# Altium schematic sheet PowerSupply.SchDoc: Power Supplies
size A3; ApprovedBy: Yves Chevallier; CheckedBy: Yves Chevallier; Author: Yves Chevallier; CompanyName: HEIG-VD; DrawnBy: Yves Chevallier; Engineer: Yves Chevallier; Organization: HEIG-VD; Address1: HEIG-VD; Address2: CH-1400 Yverdon-les-Bains; Address3: +41 21 557 73 77; Address4: +41 24 557 63 20; DocumentNumber: ABC.00.0000.000.0; Revision: v2.0.0; SheetNumber: 1; SheetTotal: 6; DrawnByDate: 2008-01-01; ExecutionWarrantDate: 2008-01-01; ExecutionWarrant: Yves Chevallier; Context: CRH; PageSetup: Record=PageOptions|CenterHorizontal=True|CenterVertical=False|PrintScale=0.97|XCorrection=1.00|YCorrection=1.00|PrintKind=0|BorderSize=5000000|LeftOffset=0|BottomOffset=0|Orientation=2|PaperLength=1000|PaperWidth=1000|Scale=100|PaperSource=262|PrintQuality=600|MediaType=1|DitherType=10|PaperKind=A4|PrintScaleMode=1; EngineerDate: 2008 -01-01; CheckedByDate: 2008-01-01; ProjectName: PRJ
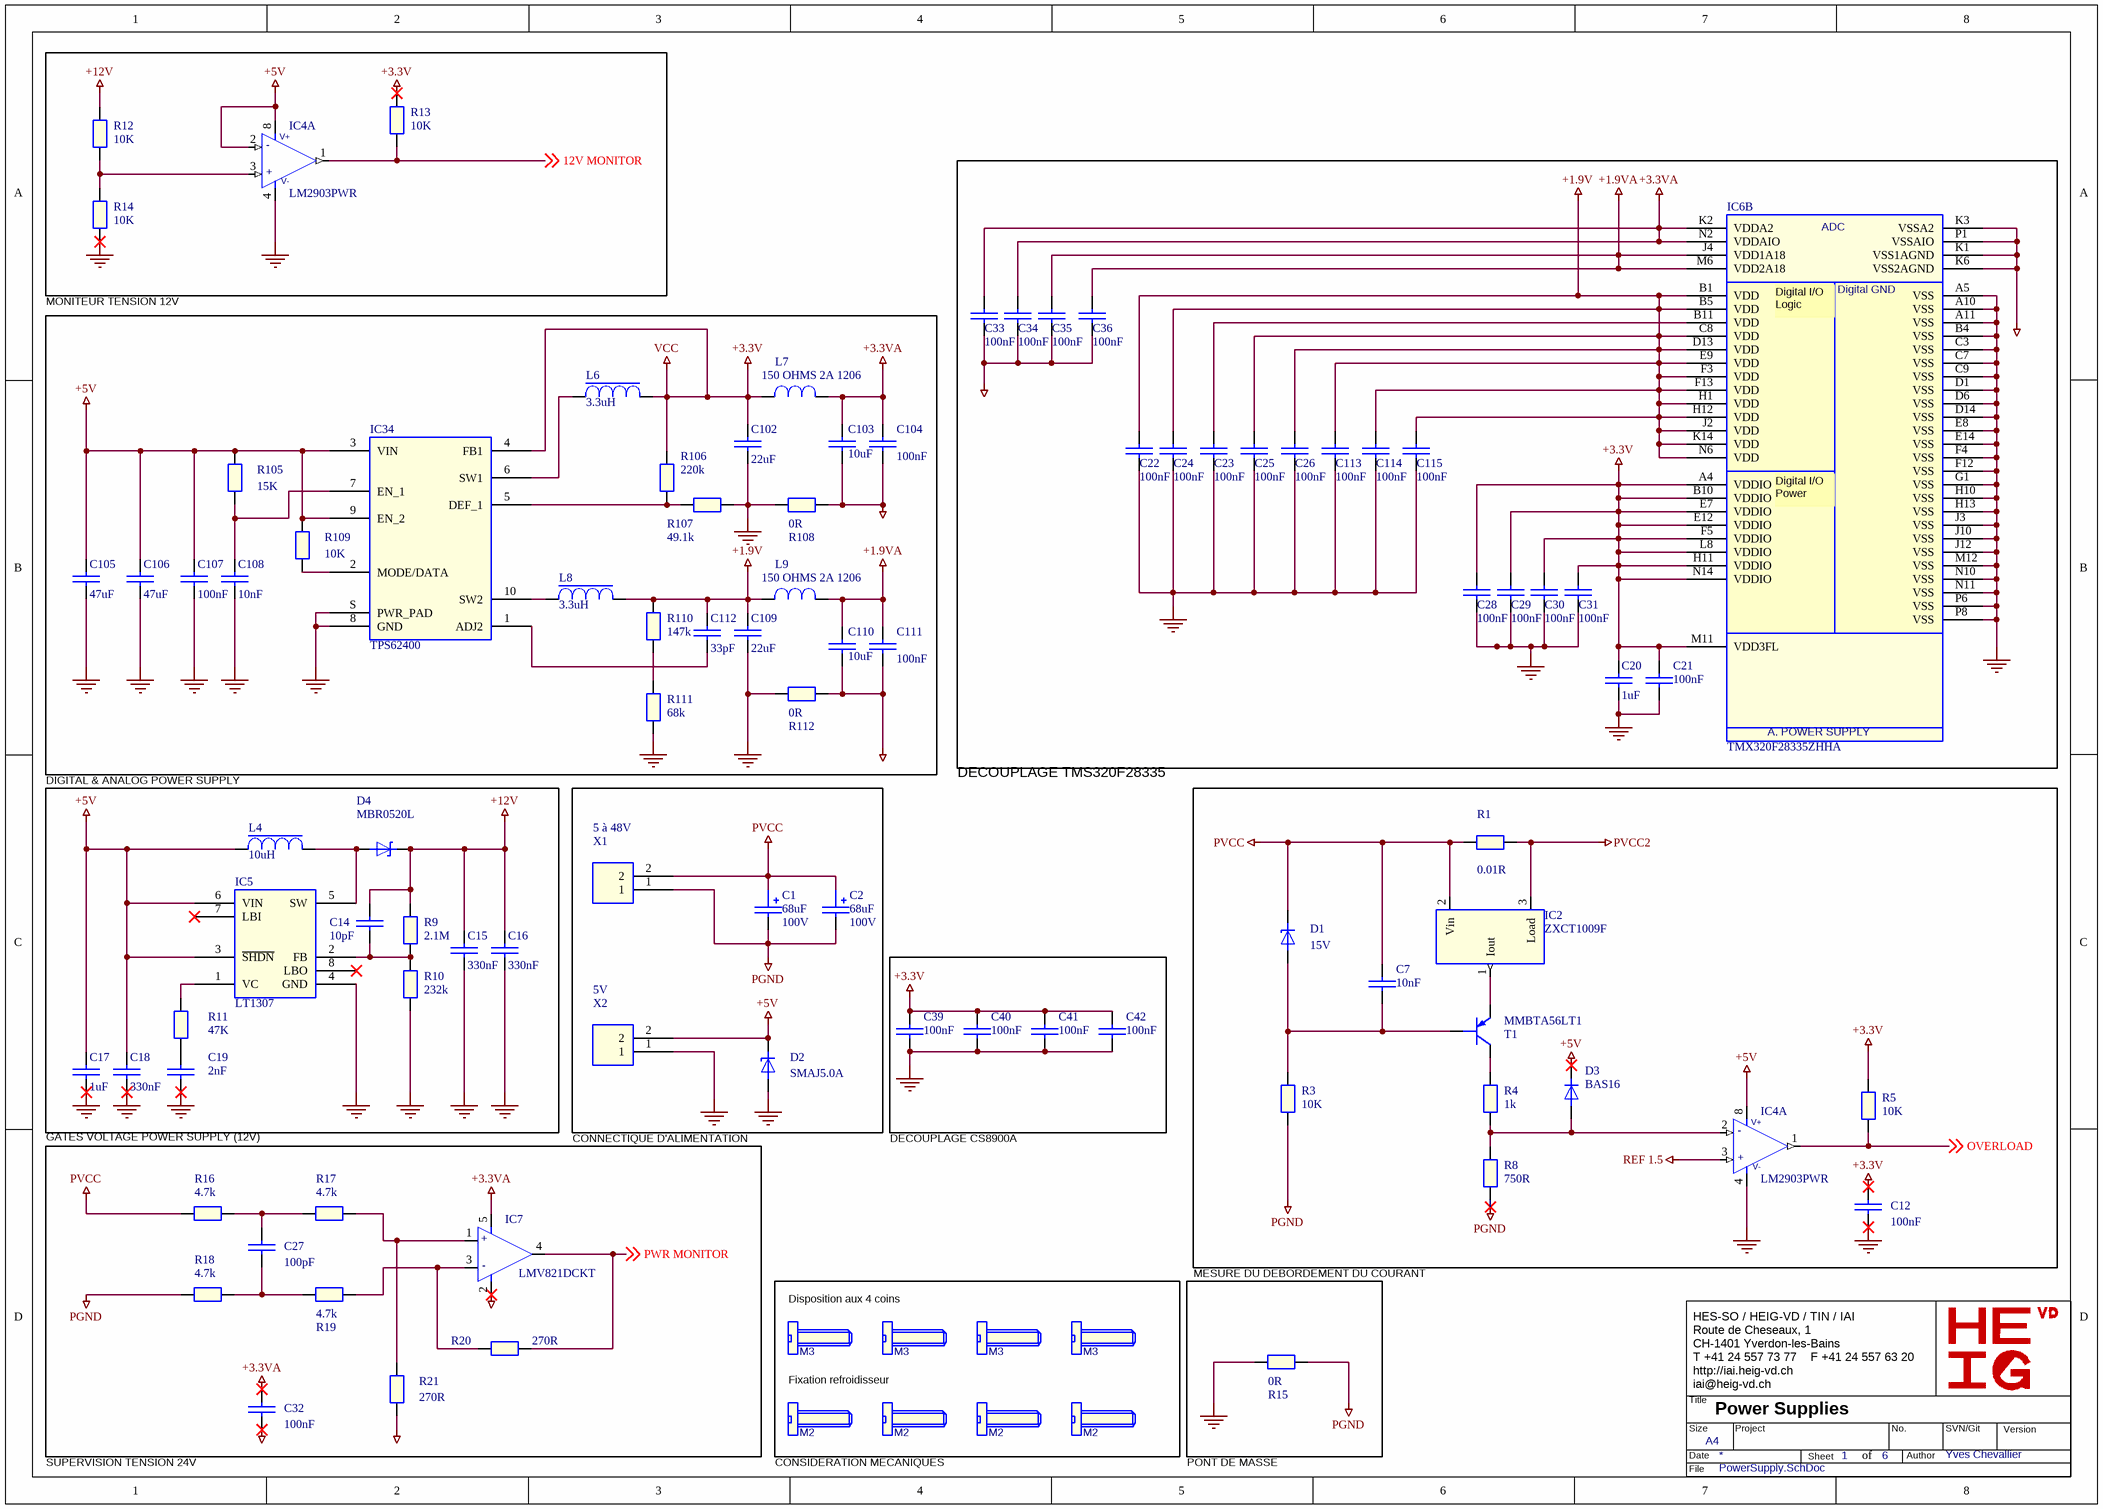
[diagram p0: PowerSupply.SchDoc]

## Parts
(Parts that share a designator on the sheet are numbered #1, #2 ... from top to bottom, then left to right.)
C1  68uF  Voltage: 100V  [SM/C_0805]
C2  68uF  Voltage: 100V  [SM/C_0805]
C7  10nF  [SM/C_0805]
C12  100nF  [SM/C_0805]
C14  10pF  [SM/C_0805]
C15  330nF  [SM/C_0805]
C16  330nF  [SM/C_0805]
C17  1uF  [SM/C_0805]
C18  330nF  [SM/C_0805]
C19  2nF  [SM/C_0805]
C20  1uF  [SM/C_0805]
C21  100nF  [SM/C_0805]
C22  100nF  [SM/C_0805]
C23  100nF  [SM/C_0805]
C24  100nF  [SM/C_0805]
C25  100nF  [SM/C_0805]
C26  100nF  [SM/C_0805]
C27  100pF  [SM/C_0805]
C28  100nF  [SM/C_0805]
C29  100nF  [SM/C_0805]
C30  100nF  [SM/C_0805]
C31  100nF  [SM/C_0805]
C32  100nF  [SM/C_0805]
C33  100nF  [SM/C_0805]
C34  100nF  [SM/C_0805]
C35  100nF  [SM/C_0805]
C36  100nF  [SM/C_0805]
C39  100nF  [SM/C_0805]
C40  100nF  [SM/C_0805]
C41  100nF  [SM/C_0805]
C42  100nF  [SM/C_0805]
C102  22uF  [SM/C_0805]
C103  10uF  [SM/C_0805]
C104  100nF  [SM/C_0805]
C105  47uF  [SM/C_0805]
C106  47uF  [SM/C_0805]
C107  100nF  [SM/C_0805]
C108  10nF  [SM/C_0805]
C109  22uF  [SM/C_0805]
C110  10uF  [SM/C_0805]
C111  100nF  [SM/C_0805]
C112  33pF  [SM/C_0805]
C113  100nF  [SM/C_0805]
C114  100nF  [SM/C_0805]
C115  100nF  [SM/C_0805]
D1  15V  [HEIG/SM/SOT23]
D2  SMAJ5.0A  [SM/DO214AA_12]
D3  BAS16  [HEIG/SM/SOT23]
D4  MBR0520L  [HEIG/SM/SOD123]
H1  M3  [M3]  (value not drawn)
H2  M3  [M3]  (value not drawn)
H3  M3  [M3]  (value not drawn)
H4  M3  [M3]  (value not drawn)
H5  M2  [M3]  (value not drawn)
H6  M2  [M3]  (value not drawn)
H7  M2  [M3]  (value not drawn)
H8  M2  [M3]  (value not drawn)
IC2  ZXCT1009F  [HEIG/SM/SOT23]
IC4#1  LM2903PWR  [HEIG/SM/TSSOP8]  (part A of 2)
IC4#2  LM2903PWR  [HEIG/SM/TSSOP8]  (part A of 2)
IC5  LT1307  [HEIG/SM/SOIC8]
IC6  TMX320F28335ZHHA  [HEIG/BGA/MICROSTAR/S-PBGA-N179]  (part B of 2)
IC7  LMV821DCKT  [HEIG/SM/SC70]
IC34  TPS62400  [HEIG/TI/S-PVSON-N10]
L4  10uH  [HEIG/SM/L_2520]
L6  3.3uH  [HEIG/COILS/VLF4012A]
L7  150 OHMS 2A 1206  [SM/L_1206]
L8  3.3uH  [HEIG/COILS/VLF4012A]
L9  150 OHMS 2A 1206  [SM/L_1206]
R1  0.01R  [R400]
R3  10K  [R400]
R4  1k  [R400]
R5  10K  [R400]
R8  750R  [R400]
R9  2.1M  [SM/R_0805]
R10  232k  [SM/R_0805]
R11  47K  [SM/R_0805]
R12  10K  [R400]
R13  10K  [R400]
R14  10K  [R400]
R15  0R  [SM/R_0805]
R16  4.7k  [R400]
R17  4.7k  [R400]
R18  4.7k  [R400]
R19  4.7k  [R400]
R20  270R  [R400]
R21  270R  [R400]
R105  15K  [SM/R_0805]
R106  220k  [SM/R_0805]
R107  49.1k  [SM/R_0805]
R108  0R  [SM/R_0805]
R109  10K  [SM/R_0805]
R110  147k  [SM/R_0805]
R111  68k  [SM/R_0805]
R112  0R  [SM/R_0805]
T1  MMBTA56LT1  [HEIG/SM/SOT23]
X1  5 à 48V  [HEIG/PHOENIX/MC 2.5/ 2-G-5.08]
X2  5V  [HEIG/PHOENIX/MC 1,5/ 2-G-3,81]

## Blocks framed on the sheet
MONITEUR TENSION 12V: C102-C112 IC34 L6-L9 R105-R112
DIGITAL & ANALOG POWER SUPPLY: C14-C19 D4 IC5 L4 R9-R11
MESURE DU DEBORDEMENT DU COURANT: R15

## Nets
+1.9V: C22.1 C24.1 C25.1 C26.1 C109.1 C112.1 C113.1 C114.1 C115.1 IC6.B1(VDD) IC6.B5(VDD) IC6.C8(VDD) IC6.D13(VDD) IC6.E9(VDD) IC6.F3(VDD) IC6.F13(VDD) IC6.H1(VDD) IC6.H12(VDD) IC6.J2(VDD) IC6.K14(VDD) IC6.N6(VDD) L8.2 L9.1 R110.2
+1.9VA: C35.1 C36.1 C110.1 C111.1 IC6.J4(VDD1A18) IC6.M6(VDD2A18) L9.2
+3.3V: C12.2 C20.1 C21.1 C28.1 C29.1 C30.1 C31.1 C39.1 C40.1 C41.1 C42.1 C102.1 IC6.A4(VDDIO) IC6.B10(VDDIO) IC6.E7(VDDIO) IC6.E12(VDDIO) IC6.F5(VDDIO) IC6.H11(VDDIO) IC6.L8(VDDIO) IC6.M11(VDD3FL) IC6.N14(VDDIO) IC34.4(FB1) L6.2 L7.1 R5.1 R13.1 R106.2  [also labelled VCC]
+3.3VA: C32.2 C33.1 C34.1 C103.1 C104.1 IC6.K2(VDDA2) IC6.N2(VDDAIO) IC7.5(VCC) L7.2
+5V: C17.1 C18.1 C105.1 C106.1 C107.1 D2.1 D3.3(k) IC4#1.2(IN-) IC4#1.8(VCC) IC4#2.8(VCC) IC5.3(~{SHDN}) IC5.6(VIN) IC34.3(VIN) IC34.9(EN_2) L4.1 R105.2 R109.2 X2.2
+12V: C14.1 C15.1 C16.1 D4.2(k) R9.2 R12.1
AGND: C32.1 C33.2 C34.2 C35.2 C36.2 C103.2 C104.2 C110.2 C111.2 IC6.K1(VSS1AGND) IC6.K3(VSSA2) IC6.K6(VSS2AGND) IC6.P1(VSSAIO) IC7.2(GND) R21.1 R108.2 R112.2
GND: C12.1 C15.2 C16.2 C17.2 C18.2 C19.2 C20.2 C21.2 C22.2 C23.2 C24.2 C25.2 C26.2 C28.2 C29.2 C30.2 C31.2 C39.2 C40.2 C41.2 C42.2 C102.2 C105.2 C106.2 C107.2 C108.2 C109.2 C113.2 C114.2 C115.2 D2.2 IC4#1.4(GND) IC4#2.4(GND) IC5.4(GND) IC6.A5(VSS) IC6.A10(VSS) IC6.A11(VSS) IC6.B4(VSS) IC6.C3(VSS) IC6.C7(VSS) IC6.C9(VSS) IC6.D1(VSS) IC6.D6(VSS) IC6.D14(VSS) IC6.E8(VSS) IC6.E14(VSS) IC6.F4(VSS) IC6.F12(VSS) IC6.G1(VSS) IC6.H10(VSS) IC6.H13(VSS) IC6.J3(VSS) IC6.J10(VSS) IC6.J12(VSS) IC6.M12(VSS) IC6.N10(VSS) IC6.N11(VSS) IC6.P6(VSS) IC6.P8(VSS) IC34.8(GND) IC34.S(PWR_PAD) R10.1 R14.2 R15.1 R107.2 R108.1 R111.1 R112.1 X2.1
PGND: C1.2 C2.2 R3.2 R8.2 R15.2 R18.1 X1.1
PVCC: C1.1 C2.1 C7.1 D1.3(k) IC2.2(Vin) R1.1 R16.1 X1.2
PVCC2: IC2.3(Load) R1.2
REF 1.5: IC4#2.3(IN+)
12V MONITOR: IC4#1.1(out) R13.2 ; off-sheet 12V MONITOR
OVERLOAD: IC4#2.1(out) R5.2 ; off-sheet OVERLOAD
PWR MONITOR: IC7.4(out) R20.2 ; off-sheet PWR MONITOR
NetC7_2: C7.2 D1.1(a) R3.1 T1.1(B)
NetC14_2: C14.2 IC5.2(FB) R9.1 R10.2
NetC19_1: C19.1 R11.1
NetC23_1: C23.1 IC6.B11(VDD)
NetC27_1: C27.1 R18.2 R19.1
NetC27_2: C27.2 R16.2 R17.1
NetC108_1: C108.1 IC34.7(EN_1) R105.1
NetC112_2: C112.2 IC34.1(ADJ2)
NetD3_1: D3.1(a) IC4#2.2(IN-) R4.2 R8.1
NetD4_1: D4.1(a) IC5.5(SW) L4.2
NetIC2_1: IC2.1(Iout) T1.2(E)
NetIC4#1_3: IC4#1.3(IN+) R12.2 R14.1
NetIC5_1: IC5.1(VC) R11.2
NetIC7_1: IC7.1(IN+) R17.2 R21.2
NetIC7_3: IC7.3(IN-) R19.2 R20.1
NetIC34_2: IC34.2(MODE/DATA) R109.1
NetIC34_5: IC34.5(DEF_1) R106.1 R107.1
NetIC34_6: IC34.6(SW1) L6.1
NetIC34_10: IC34.10(SW2) L8.1
NetR4_1: R4.1 T1.3(C)
NetR110_1: R110.1 R111.2

Not connected (* = marked no-connect by the designer): H1 1(EARTH); H2 1(EARTH); H3 1(EARTH); H4 1(EARTH); H5 1(EARTH); H6 1(EARTH); H7 1(EARTH); H8 1(EARTH); IC5 7(LBI)* 8(LBO)*

## Notes on the sheet
- DECOUPLAGE TMS320F28335
- GATES VOLTAGE POWER SUPPLY (12V)
- CONNECTIQUE D'ALIMENTATION
- DECOUPLAGE CS8900A
- Disposition aux 4 coins
- Fixation refroidisseur
- SUPERVISION TENSION 24V
- CONSIDERATION MECANIQUES
- PONT DE MASSE
- HES-SO / HEIG-VD / TIN / IAI
  Route de Cheseaux, 1
  CH-1401 Yverdon-les-Bains
  T +41 24 557 73 77    F +41 24 557 63 20
  http://iai.heig-vd.ch
  iai@heig-vd.ch
- Title
- Size
- Date
- A4
- Project
- Sheet
- of
- No.
- Author
- SVN/Git
- Version
- File
- (in symbol LM2903, part A) V+; -; +; V-
- (in symbol LMV821DCKT_0) +; -
- (in symbol TMS320F2833xZHH, part B) ADC; Digital GND; Digital I/O / Logic; Digital I/O / Power; A. POWER SUPPLY

## Library data of the parts
C1 C2 = C+: Quantité min: 1; Fabricant: PANASONIC; Prix: 2.80; Ref. Fabricant: EEVFK2A680Q; Ref. Fab: ECA1CM471.PANASONIC; PCB Footprint: HEIG/SM/CT_H13; Ref. Distributeur: 9696156; Distributeur: Farnell; Price in €: 0.20; Ref. Distributor: 320-1508; Distributor: Farnell
C7 = C: Quantité min: 5; Prix: 0.16; Ref. Fabricant: 06031C103K4Z2A; Fabricant: AVX; Tolerance: 5%; Voltage: 50V; PCB Footprint: HEIG/SM/C_0603; Distributeur: Farnell; Ref. Distributeur: 1301715; Price: 0.07; Price in €: 0.07
C12 = C: Quantité min: 10; Ref. Fabricant: 2238 786 15649; Fabricant: PHYCOMP; Prix: 0.113; Voltage: 16V; Tolerance: 10%; PCB Footprint: HEIG/SM/C_0603; Ref. Distributeur: 432210; Distributeur: Farnell; Price: 0.04
C14 = C_Dup1: Ref. Fabricant: 06035A100JAT2A; Prix: 0.066; Ref. Fab: AVXMCCTA106M006.MULTICOMP; VOLTAGE: 10V; Référence: 757-720; Prix Unitaire: 0.40; Fabricant: AVX; Quantité min: 10; PCB Footprint: HEIG/SM/C_0603; Ref. Distributeur: 499110; Distributeur: Farnell; Price in €: 0.87; Ref. Distributor: 967-014; Distributor: Farnell
C15 C16 = C_Dup1: Ref. Fabricant: B37941K0334K60; Prix: 0.123; Ref. Fab: AVXMCCTA106M006.MULTICOMP; VOLTAGE: 25V; Référence: 757-720; Prix Unitaire: 0.40; Fabricant: EPCOS; Quantité min: 10; Tolérance: 10%; Ref. Distributeur: 8805660; Distributeur: Farnell; Price in €: 0.87; Ref. Distributor: 967-014; Distributor: Farnell; PCB Footprint: SM/C_0805
C17 C20 = C_Dup1: Prix Unitaire: 0.40; Référence: 757-720; VOLTAGE: 10V; Ref. Fab: AVXMCCTA106M006.MULTICOMP; Prix: 0.221; Ref. Fabricant: 06036D105KAT2A; Fabricant: AVX; Quantité min: 10; Tolérance: 10%; PCB Footprint: HEIG/SM/C_0603; Distributor: Farnell; Ref. Distributor: 967-014; Price in €: 0.87; Distributeur: Farnell; Ref. Distributeur: 1327676
C18 = C_Dup1: Ref. Fabricant: 0603YD334KAT2A; Prix: 0.382; Ref. Fab: AVXMCCTA106M006.MULTICOMP; VOLTAGE: 16V; Référence: 757-720; Prix Unitaire: 0.40; Fabricant: MULTICOMP; Tolérance: 10%; Quantité min: 10; PCB Footprint: HEIG/SM/C_0603; Ref. Distributeur: 1327681; Distributeur: Farnell; Price in €: 0.87; Ref. Distributor: 967-014; Distributor: Farnell
C19 = C_Dup1: Ref. Fabricant: 06035C222KAT2A; Prix: 0.098; Ref. Fab: AVXMCCTA106M006.MULTICOMP; VOLTAGE: 10V; Référence: 757-720; Prix Unitaire: 0.40; Fabricant: AVX; Quantité min: 10; Tolérance: 10%; PCB Footprint: HEIG/SM/C_0603; Ref. Distributeur: 498592; Distributeur: Farnell; Price in €: 0.87; Ref. Distributor: 967-014; Distributor: Farnell
C21 = C_Dup1: Quantité min: 10; Fabricant: PHYCOMP; Ref. Fabricant: 2238 786 15649; Prix: 0.113; Ref. Fab: AVX; Voltage: 16V; PCB Footprint: HEIG/SM/C_0603; Distributeur: Farnell; Ref. Distributeur: 432210; Distributor: Farnell; Price in €: 0.140; Ref. Distributor: 499-687
C22 C23 C25 C26 C33 C113-C115 = C_Dup1: Référence: 499-687; Prix Unitaire: 0.14; Ref. Fab: AVX; Prix: 0.113; Ref. Fabricant: 2238 786 15649; Fabricant: PHYCOMP; Quantité min: 10; Voltage: 16V; PCB Footprint: HEIG/SM/C_0402; Distributor: Farnell; Ref. Distributor: 499-687; Price in €: 0.140; Distributeur: Farnell
C24 = C_Dup1: Voltage: 16V; Ref. Fabricant: 2238 786 15649; Prix: 0.113; Ref. Fab: AVX; Prix Unitaire: 0.14; Référence: 499-687; Fabricant: PHYCOMP; Quantité min: 10; PCB Footprint: HEIG/SM/C_0402; Distributeur: Farnell; Price in €: 0.140; Ref. Distributor: 499-687; Distributor: Farnell
C27 = C_Dup1: Quantité min: 10; Fabricant: MURATA; Ref. Fab: AVX; Prix Unitaire: 0.14; Référence: 499-687; Prix: 0.071; Ref. Fabricant: GRM1885C1H101JA01D; PCB Footprint: HEIG/SM/C_0603; Price in €: 0.140; Ref. Distributor: 499-687; Distributor: Farnell; Distributeur: Farnell; Ref. Distributeur: 8819866
C28 = C_Dup1: Voltage: 16V; Quantité min: 10; Fabricant: PHYCOMP; Ref. Fabricant: 2238 786 15649; Prix: 0.113; Ref. Fab: AVX; Référence: 499-687; Prix Unitaire: 0.14; PCB Footprint: HEIG/SM/C_0402; Distributeur: Farnell; Price in €: 0.140; Ref. Distributor: 499-687; Distributor: Farnell
C29 C30 = C_Dup1: Prix Unitaire: 0.14; Référence: 499-687; Ref. Fab: AVX; Prix: 0.113; Ref. Fabricant: 2238 786 15649; Fabricant: PHYCOMP; Quantité min: 10; Voltage: 16V; PCB Footprint: HEIG/SM/C_0402; Distributor: Farnell; Ref. Distributor: 499-687; Price in €: 0.140; Distributeur: Farnell
C31 = C_Dup1: Quantité min: 10; Fabricant: PHYCOMP; Ref. Fabricant: 2238 786 15649; Prix: 0.113; Ref. Fab: AVX; Référence: 499-687; Prix Unitaire: 0.14; Voltage: 16V; PCB Footprint: HEIG/SM/C_0402; Distributeur: Farnell; Price in €: 0.140; Ref. Distributor: 499-687; Distributor: Farnell
C32 = C_Dup1: Voltage: 16V; Quantité min: 10; Fabricant: PHYCOMP; Ref. Fabricant: 2238 786 15649; Prix: 0.113; Référence: 499-687; Prix Unitaire: 0.14; Ref. Fab: AVX; PCB Footprint: HEIG/SM/C_0603; Ref. Distributeur: 432210; Distributeur: Farnell; Distributor: Farnell; Ref. Distributor: 499-687; Price in €: 0.140
C34 = C_Dup1: Voltage: 16V; Quantité min: 10; Fabricant: PHYCOMP; Ref. Fabricant: 2238 786 15649; Prix: 0.113; Ref. Fab: AVX; Prix Unitaire: 0.14; Référence: 499-687; PCB Footprint: HEIG/SM/C_0402; Distributeur: Farnell; Price in €: 0.140; Ref. Distributor: 499-687; Distributor: Farnell
C35 = C_Dup1: Ref. Fab: AVX; Prix Unitaire: 0.14; Référence: 499-687; Prix: 0.113; Ref. Fabricant: 2238 786 15649; Fabricant: PHYCOMP; Quantité min: 10; Voltage: 16V; PCB Footprint: HEIG/SM/C_0402; Price in €: 0.140; Ref. Distributor: 499-687; Distributor: Farnell; Distributeur: Farnell
C36 = C_Dup1: Voltage: 16V; Quantité min: 10; Fabricant: PHYCOMP; Ref. Fabricant: 2238 786 15649; Prix: 0.113; Référence: 499-687; Prix Unitaire: 0.14; Ref. Fab: AVX; PCB Footprint: HEIG/SM/C_0402; Distributeur: Farnell; Distributor: Farnell; Ref. Distributor: 499-687; Price in €: 0.140
C39 C40 = C_Dup1: PCB Footprint: HEIG/SM/C_0603; Voltage: 16V; Quantité min: 10; Fabricant: PHYCOMP; Ref. Fabricant: 2238 786 15649; Prix: 0.113; Ref. Fab: AVX; Référence: 499-687; Prix Unitaire: 0.14; Ref. Distributeur: 432210; Distributeur: Farnell; Price in €: 0.140; Ref. Distributor: 499-687; Distributor: Farnell
C41 C42 = C_Dup1: PCB Footprint: HEIG/SM/C_0603; Voltage: 16V; Prix Unitaire: 0.14; Référence: 499-687; Ref. Fab: AVX; Prix: 0.113; Ref. Fabricant: 2238 786 15649; Fabricant: PHYCOMP; Quantité min: 10; Distributor: Farnell; Ref. Distributor: 499-687; Price in €: 0.140; Distributeur: Farnell; Ref. Distributeur: 432210
C102 = C_Dup1: PCB Footprint: HEIG/SM/C_1206; Ref. Fabricant: C1206C226K9PAC; Prix: 1.15; Prix Unitaire: 0.40; Référence: 757-720; VOLTAGE: 6.3V; Ref. Fab: AVXMCCTA106M006.MULTICOMP; Fabricant: AVX; Quantité min: 1; Distributeur: Farnell; Ref. Distributeur: 1288265; Distributor: Farnell; Ref. Distributor: 967-014; Price in €: 0.87
C103 = C_Dup1: PCB Footprint: HEIG/SM/C_0805; Ref. Fabricant: C0805C106K9PAC; Prix: 0.55; Ref. Fab: AVXMCCTA106M006.MULTICOMP; VOLTAGE: 6.3V; Référence: 757-720; Prix Unitaire: 0.40; Fabricant: KEMET; Quantité min: 10; Ref. Distributeur: 9227814; Distributeur: Farnell; Price in €: 0.87; Ref. Distributor: 967-014; Distributor: Farnell
C104 C111 = C_Dup1: Quantité min: 10; Voltage: 16V; Fabricant: PHYCOMP; Ref. Fabricant: 2238 786 15649; Prix: 0.113; Référence: 499-687; Prix Unitaire: 0.14; Ref. Fab: AVX; PCB Footprint: HEIG/SM/C_0603; Ref. Distributeur: 432210; Distributeur: Farnell; Distributor: Farnell; Ref. Distributor: 499-687; Price in €: 0.140
C105 C106 = C_Dup1: PCB Footprint: HEIG/SM/C_1206; Prix Unitaire: 0.40; Référence: 757-720; VOLTAGE: 6.3V; Ref. Fab: AVXMCCTA106M006.MULTICOMP; Prix: 8.20; Ref. Fabricant: 12106D476MAT2A; Fabricant: AVX; Quantité min: 1; Distributor: Farnell; Ref. Distributor: 967-014; Price in €: 0.87; Distributeur: Farnell; Ref. Distributeur: 1327743
C107 C108 C112 = C_Dup1: PCB Footprint: HEIG/SM/C_0603; Prix Unitaire: 0.40; Référence: 757-720; VOLTAGE: 10V; Ref. Fab: AVXMCCTA106M006.MULTICOMP; Quantité min: 1; Distributor: Farnell; Ref. Distributor: 967-014; Price in €: 0.87; Distributeur: Farnell
C109 = C_Dup1: PCB Footprint: HEIG/SM/C_1206; Prix Unitaire: 0.40; Référence: 757-720; VOLTAGE: 6.3V; Ref. Fab: AVXMCCTA106M006.MULTICOMP; Prix: 1.15; Ref. Fabricant: C1206C226K9PAC; Fabricant: AVX; Quantité min: 1; Distributor: Farnell; Ref. Distributor: 967-014; Price in €: 0.87; Distributeur: Farnell; Ref. Distributeur: 1288265
C110 = C_Dup1: PCB Footprint: HEIG/SM/C_0805; Ref. Fab: AVXMCCTA106M006.MULTICOMP; VOLTAGE: 6.3V; Référence: 757-720; Prix Unitaire: 0.40; Prix: 0.55; Ref. Fabricant: C0805C106K9PAC; Fabricant: KEMET; Quantité min: 10; Price in €: 0.87; Ref. Distributor: 967-014; Distributor: Farnell; Distributeur: Farnell; Ref. Distributeur: 9227814
D1 = D Zener_1: Fabricant: MULTICOMP; Ref. Fabricant: BZX84C15; Prix: 0.167; Quantité min: 5; Price: 0.19; Distributeur: Farnell; Ref. Distributeur: 1466585; Voltage: BZX84C15; PCB Footprint: HEIG/SM/SOT23
D2 = D Zener_0: Quantité min: 1; Fabricant: VISHAY GENERAL SEMICONDUCTOR; Prix: 0.989; Distributeur: Farnell; Ref. Distributeur: 9550941; Ref. Fabricant: SMAJ5.0A; Distributor: Farnell; PCB Footprint: SM/DO214AA_12
D3 = D_0: Fabricant: NXP; Prix: 0.196; Quantité min: 10; Price: 0.19; Ref. Distributeur: 1081180; Distributeur: Farnell; Ref. Fabricant: BAS16; PCB Footprint: HEIG/SM/SOT23
D4 = D Schottky: Quantité min: 1; Prix: 0.12; Fabricant: FAIRCHILD SEMICONDUCTOR; Ref. Fabricant: MBR0520L; Ref. Distributeur: 1467521; Distributeur: Farnell; PCB Footprint: HEIG/SM/SOD123
H1-H4 = M3: PCB Footprint: HEIG/HOLE/M3
H5-H8 = M3_0: PCB Footprint: HEIG/HOLE/M2; Price in €: 0.60; Ref. Distributor: 34 11 30; Distributor: Distrelec; Ref. Fab: -
IC2 = ZXCT1009: Quantité min: 1; Prix: 2.90; Fabricant: ZETEX; Ref. Fabricant: ZXCT1009F; Distributeur: Farnell; Ref. Distributeur: 1132757; Price: 2.3; PCB Footprint: HEIG/SM/SOT23
IC4#1 IC4#2 = LM2903: Quantité min: 1; Prix: 0.554; Fabricant: TEXAS INSTRUMENTS; Ref. Fabricant: LM2903PWR; Distributeur: Farnell; Ref. Distributeur: 8389209; Price: 0.56; PCB Footprint: HEIG/SM/TSSOP8
IC5 = LT1307: Ref. Fabricant: LT1307BCS8#PBF; Prix: 8.70; Quantité min: 1; Fabricant: LINEAR TECHNOLOGY; Distributeur: Farnell; Ref. Distributeur: 1273725; PCB Footprint: HEIG/SM/SOIC8
IC6 = TMS320F2833xZHH: Fabricant: TEXAS INSTRUMENTS; Prix: 94.45; Quantité min: 1; Distributeur: Farnell; Ref. Distributeur: 1503814; Ref. Fabricant: TMX320F28335ZHHA; PCB Footprint: HEIG/BGA/MICROSTAR/S-PBGA-N179
IC7 = LMV821DCKT_0: Quantité min: 1; Fabricant: TEXAS INSTRUMENTS; Prix: 1.45; Ref. Fabricant: LMV821IDCKTE4; PCB Footprint: HEIG/SM/SC70; Distributor: Spoerle; Ref. Fab: LMV821DCKT; Ref. Distributor: LMV821DCKT; Price in €: 0.7; Ref. Distributeur: 1053752; Distributeur: Farnell
IC34 = TPS62400_1: PCB Footprint: HEIG/TI/S-PVSON-N10
L4 = L Noyau: Ref. Fabricant: ELJFC100JF; Prix: 1; Quantité min: 5; Tolérance: 5%; Fabricant: PANASONIC; Distributeur: Farnell; Ref. Distributeur: 1198424; PCB Footprint: HEIG/SM/L_2520
L6 L8 = L Noyau: Quantité min: 1; Fabricant: TDK; Ref. Fabricant: VLF4012AT-3R3M1R3; Prix: 3.90; PCB Footprint: HEIG/COILS/VLF4012A; Distributeur: Farnell; Ref. Distributeur: 1301686
L7 = L Symbole 3 spires: Ref. Fab: epocs; Prix: 0.552; Ref. Fabricant: MLB-321611-0150PN; Fabricant: KITAGAWA; Quantité min: 10; Distributor: Farnell; Price in €: 0.98; Ref. Distributor: 200-610; Ref. Distributeur: 1308791; Distributeur: Farnell; PCB Footprint: SM/L_1206
L9 = L Symbole 3 spires: Quantité min: 10; Fabricant: KITAGAWA; Ref. Fabricant: MLB-321611-0150PN; Prix: 0.552; Ref. Fab: epocs; Distributeur: Farnell; Ref. Distributeur: 1308791; Distributor: Farnell; Price in €: 0.98; Ref. Distributor: 200-610; PCB Footprint: SM/L_1206
R1 = R_Dup1: Quantité min: 5; Fabricant: VISHAY DALE; Ref. Fabricant: WSR-5 .01 1% EA E2; Prix: 4.20; PCB Footprint: WSR-5; Distributeur: Farnell; Ref. Distributeur: 1107476
R3 = R_Dup1: Quantité min: 50; Ref. Fabricant: 232270260103; Fabricant: PHYCOMP; Prix: 0.113; Tolerance: 5%; Power: 0.063W; PCB Footprint: HEIG/SM/R_0603; Ref. Distributeur: 9233504; Distributeur: Farnell; Price: 0.06
R4 = R_Dup1: Quantité min: 50; Ref. Fabricant: 232270260102; Fabricant: PHYCOMP; Prix: 0.113; Tolerance: 1%; Power: 0.063W; PCB Footprint: HEIG/SM/R_0603; Ref. Distributeur: 9233385; Distributeur: Farnell; Price: 0.06
R5 = R_Dup1: Quantité min: 50; Ref. Fabricant: 232270260103; Fabricant: PHYCOMP; Prix: 0.113; Power: 0.063W; Tolerance: 5%; PCB Footprint: HEIG/SM/R_0603; Ref. Distributeur: 9233504; Distributeur: Farnell; Price: 0.06
R8 = R_Dup1: Quantité min: 50; Ref. Fabricant: MC 0.063W 0603 1% 750R; Fabricant: MULTICOMP; Prix: 0.064; Tolerance: 1%; Power: 0.063W; PCB Footprint: HEIG/SM/R_0603; Ref. Distributeur: 9331506; Distributeur: Farnell; Price: 0.06
R9 = R SMD 0805N: Prix: 0.01; Ref. Fabricant: CRCW06032M10FKEA; Fabricant: VISHAY DALE; Quantité min: 10; PCB Footprint: HEIG/SM/R_0603; Package: SMD 0805N; Ref. Distributeur: 1570725; Distributeur: Farnell
R10 = R SMD 0805N: Ref. Fabricant: CPF0603F232KC1; Prix: 0.79; Fabricant: TYCO ELECTRONICS; Quantité min: 5; Tolérance: 1%; PCB Footprint: HEIG/SM/R_0603; Package: SMD 0805N; Distributeur: Farnell; Ref. Distributeur: 1527729
R11 = R SMD 0805N: Prix: 0.056; Ref. Fabricant: 232270260473; Fabricant: PHYCOMP; Quantité min: 50; PCB Footprint: HEIG/SM/R_0603; Package: SMD 0805N; Ref. Distributeur: 9233580; Distributeur: Farnell
R12 = R_Dup1: Quantité min: 50; Ref. Fabricant: 232270260103; Fabricant: PHYCOMP; Prix: 0.113; Tolerance: 1%; Power: 0.063W; PCB Footprint: HEIG/SM/R_0603; Ref. Distributeur: 9233504; Distributeur: Farnell; Price: 0.06
R13 = R_Dup1: Quantité min: 50; Prix: 0.113; Ref. Fabricant: 232270260103; Fabricant: PHYCOMP; Power: 0.063W; Tolerance: 5%; PCB Footprint: HEIG/SM/R_0603; Distributeur: Farnell; Ref. Distributeur: 9233504; Price: 0.06
R14 = R_Dup1: Quantité min: 50; Prix: 0.113; Ref. Fabricant: 232270260103; Fabricant: PHYCOMP; Tolerance: 1%; Power: 0.063W; PCB Footprint: HEIG/SM/R_0603; Ref. Distributeur: 9233504; Distributeur: Farnell; Price: 0.06
R15 = R SMD 0805N: Quantité min: 50; Fabricant: MULTICOMP; Ref. Fabricant: MC 0.125W 1206 0R; Prix: 0.064; PCB Footprint: SM/R_1206; Package: SMD 0805N; Distributeur: Farnell; Ref. Distributeur: 9336974
R16-R19 = R_Dup1: Quantité min: 50; Fabricant: MULTICOMP; Prix: 0.064; Ref. Fabricant: MC 0.063W 0603 5% 4K7; PCB Footprint: HEIG/SM/R_0603; Distributeur: Farnell; Ref. Distributeur: 9332154
R20 R21 = R_Dup1: Prix: 0.064; Ref. Fabricant: MC 0.063W 0603 5% 270R; Fabricant: MULTICOMP; Quantité min: 50; PCB Footprint: HEIG/SM/R_0603; Distributeur: Farnell
R105 = R SMD 0805N: PCB Footprint: SM/R_0603; Prix: 0.064; Quantité min: 50; Package: SMD 0805N; Distributeur: Farnell
R106 R107 = R SMD 0805N: PCB Footprint: SM/R_0603; Quantité min: 50; Prix: 0.064; Package: SMD 0805N; Distributeur: Farnell
R108 = R SMD 0805N: Quantité min: 50; Fabricant: MULTICOMP; Prix: 0.064; Package: SMD 0805N; PCB Footprint: SM/R_0805; Distributeur: Farnell
R109 = R SMD 0805N: Prix: 0.064; Quantité min: 50; PCB Footprint: SM/R_0603; Package: SMD 0805N; Distributeur: Farnell
R110 = R SMD 0805N: PCB Footprint: SM/R_0603; Prix: 0.064; Ref. Fabricant: MC 0.063W 0603 1% 147K; Fabricant: MULTICOMP; Quantité min: 50; Package: SMD 0805N; Distributeur: Farnell; Ref. Distributeur: 1171002
R111 = R SMD 0805N: PCB Footprint: SM/R_0603; Prix: 0.064; Ref. Fabricant: MC 0.063W 0603 5% 68K; Fabricant: MULTICOMP; Quantité min: 50; Package: SMD 0805N; Distributeur: Farnell; Ref. Distributeur: 9332278
R112 = R SMD 0805N: Prix: 0.064; Fabricant: MULTICOMP; Quantité min: 50; Package: SMD 0805N; PCB Footprint: SM/R_0805; Distributeur: Farnell
T1 = MMBTA56LT1: Quantité min: 5; Prix: 0.182; Ref. Fabricant: MMBTA56LT1G; Fabricant: ON SEMICONDUCTOR; Ref. Distributeur: 9555900; Distributeur: Farnell; Price: 0.16; PCB Footprint: HEIG/SM/SOT23
X1 = Connecteur 02: Fabricant: PHOENIX CONTACT; Ref. Fabricant: 3705171; Prix: 0.882; Ref. Distributeur: 3705171; Distributeur: Farnell; PCB Footprint: HEIG/PHOENIX/MC 2.5/ 2-G-5.08
X2 = Connecteur 02: Quantité min: 1; Fabricant: PHOENIX CONTACT; Prix: 0.931; Ref. Fabricant: 1803277; Distributeur: Farnell; Ref. Distributeur: 3704725; PCB Footprint: HEIG/PHOENIX/MC 1,5/ 2-G-3,81